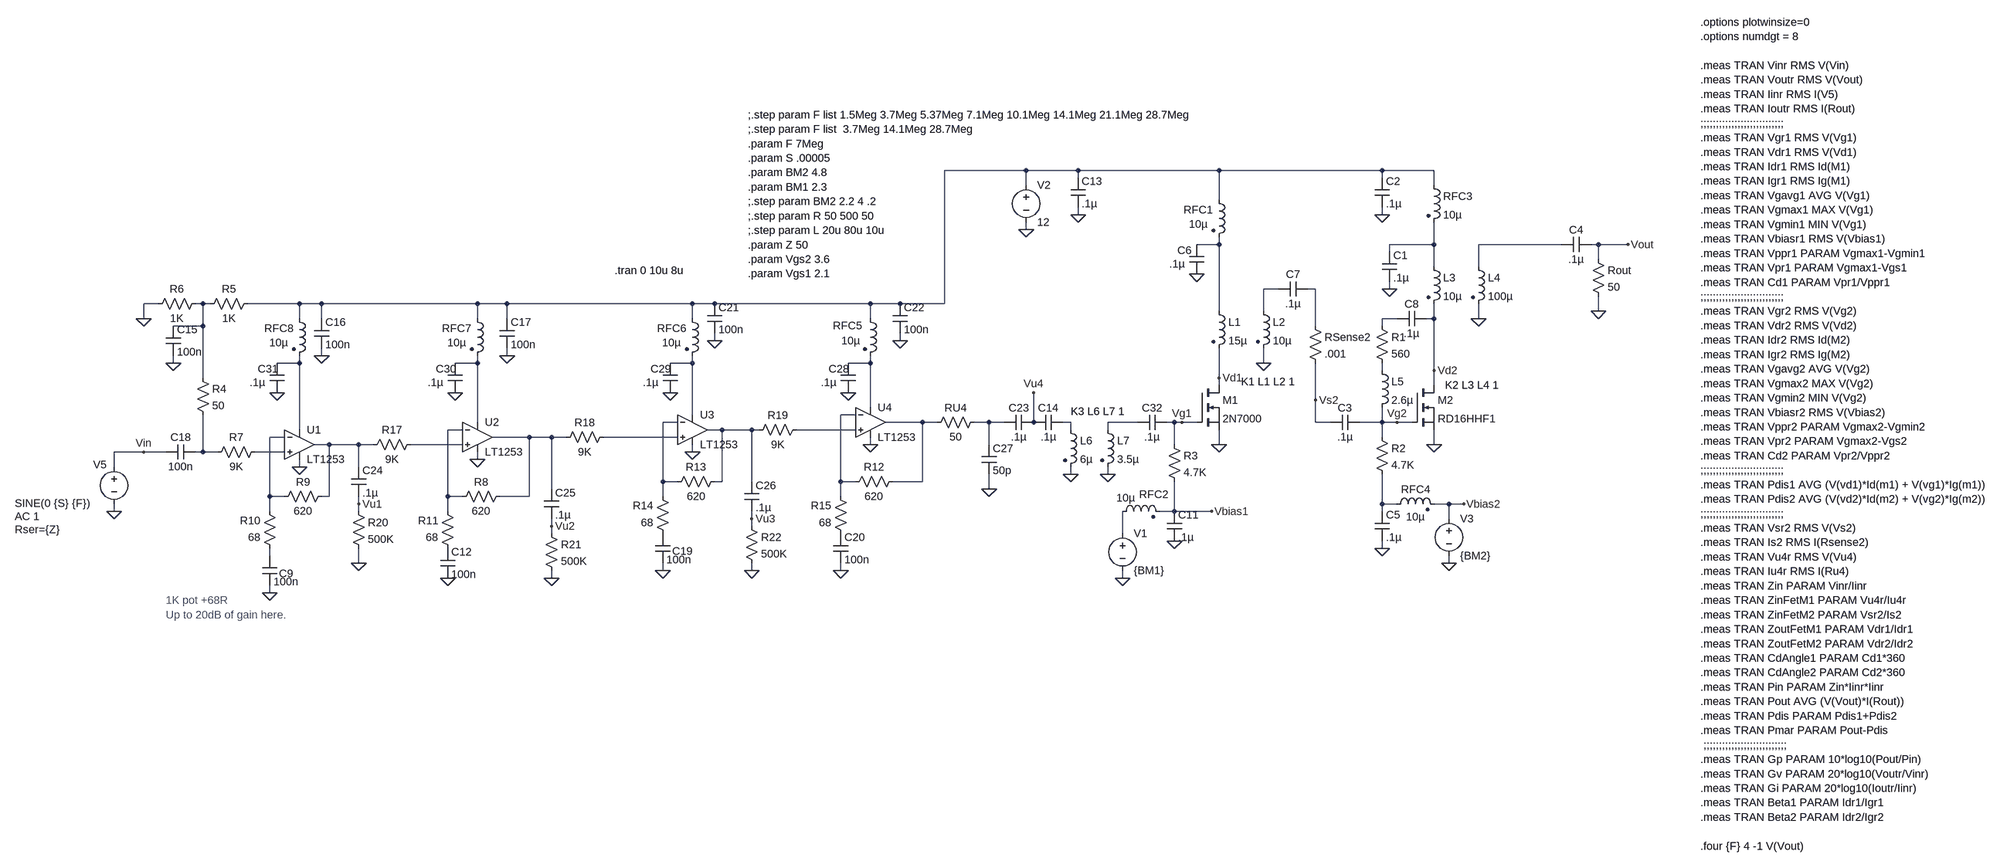
[diagram p0: schematic LT1253 2N7000 RD16HHF Power Amp Testing.asc]
LT1253 2N7000 RD16HHF Power Amp Testing.asc, the LTspice schematic file:
Version 4
SHEET 1 3136 1616
WIRE 256 -176 80 -176
WIRE 368 -176 256 -176
WIRE 672 -176 368 -176
WIRE 1024 -176 672 -176
WIRE 1136 -176 1024 -176
WIRE 368 -160 368 -176
WIRE 1024 -160 1024 -176
WIRE 256 -144 256 -176
WIRE 1136 -144 1136 -176
WIRE 672 -112 672 -176
WIRE 368 -80 368 -96
WIRE 1024 -80 1024 -96
WIRE 256 -48 256 -64
WIRE 672 -16 672 -32
WIRE 672 -16 624 -16
WIRE 1136 -16 1136 -64
WIRE 1136 -16 1040 -16
WIRE 1504 -16 1232 -16
WIRE 1584 -16 1568 -16
WIRE 1648 -16 1584 -16
WIRE 1040 0 1040 -16
WIRE 1584 16 1584 -16
WIRE 1136 32 1136 -16
WIRE 1232 32 1232 -16
WIRE 800 80 768 80
WIRE 880 80 864 80
WIRE 1040 80 1040 64
WIRE -1616 112 -1648 112
WIRE -1520 112 -1536 112
WIRE -1504 112 -1520 112
WIRE -1312 112 -1424 112
WIRE -1264 112 -1312 112
WIRE -928 112 -1264 112
WIRE -864 112 -928 112
WIRE -464 112 -864 112
WIRE -416 112 -464 112
WIRE -80 112 -416 112
WIRE -16 112 -80 112
WIRE 80 112 80 -176
WIRE 80 112 -16 112
WIRE 672 128 672 -16
WIRE 768 128 768 80
WIRE 1584 128 1584 96
WIRE -1648 144 -1648 112
WIRE -1312 144 -1312 112
WIRE -1264 144 -1264 112
WIRE -928 144 -928 112
WIRE -864 144 -864 112
WIRE -464 144 -464 112
WIRE -80 144 -80 112
WIRE 1056 144 1024 144
WIRE 1136 144 1136 112
WIRE 1136 144 1120 144
WIRE 1232 144 1232 112
WIRE -1520 160 -1520 112
WIRE -1520 160 -1584 160
WIRE 880 160 880 80
WIRE 1024 160 1024 144
WIRE -416 192 -416 176
WIRE -16 192 -16 176
WIRE -1264 224 -1264 208
WIRE -864 224 -864 208
WIRE -1584 240 -1584 224
WIRE -1312 240 -1312 224
WIRE -1312 240 -1360 240
WIRE -928 240 -928 224
WIRE -928 240 -976 240
WIRE -464 240 -464 224
WIRE -464 240 -512 240
WIRE -80 240 -80 224
WIRE -80 240 -128 240
WIRE 768 240 768 208
WIRE 1024 256 1024 240
WIRE 1136 256 1136 144
WIRE -1520 272 -1520 160
WIRE 672 272 672 208
WIRE 672 288 672 272
WIRE 1136 288 1136 256
WIRE 880 320 880 240
WIRE -80 336 -80 240
WIRE -464 352 -464 240
WIRE -112 352 -144 352
WIRE -928 368 -928 240
WIRE -496 368 -528 368
WIRE 32 368 -48 368
WIRE 64 368 32 368
WIRE 176 368 144 368
WIRE 208 368 176 368
WIRE 272 368 272 304
WIRE 352 368 336 368
WIRE 496 368 432 368
WIRE 576 368 560 368
WIRE 592 368 576 368
WIRE 624 368 592 368
WIRE 880 368 880 320
WIRE 912 368 880 368
WIRE 1024 368 1024 336
WIRE 1024 368 976 368
WIRE 1056 368 1024 368
WIRE 1088 368 1056 368
WIRE -1312 384 -1312 240
WIRE -960 384 -992 384
WIRE -400 384 -432 384
WIRE -336 384 -400 384
WIRE -320 384 -336 384
WIRE -112 384 -240 384
WIRE 352 384 352 368
WIRE 432 384 432 368
WIRE -1344 400 -1376 400
WIRE -816 400 -896 400
WIRE -768 400 -816 400
WIRE -736 400 -768 400
WIRE -496 400 -656 400
WIRE 1024 400 1024 368
WIRE -1248 416 -1280 416
WIRE -1184 416 -1248 416
WIRE -1152 416 -1184 416
WIRE -960 416 -1072 416
WIRE -80 416 -80 400
WIRE 176 416 176 368
WIRE 576 416 576 368
WIRE 672 416 672 384
WIRE 1136 416 1136 384
WIRE -1648 432 -1712 432
WIRE -1600 432 -1648 432
WIRE -1520 432 -1520 352
WIRE -1520 432 -1536 432
WIRE -1488 432 -1520 432
WIRE -1344 432 -1408 432
WIRE -464 432 -464 416
WIRE -928 448 -928 432
WIRE -1712 464 -1712 432
WIRE -1312 464 -1312 448
WIRE -1184 464 -1184 416
WIRE 352 480 352 464
WIRE 432 480 432 464
WIRE -528 496 -528 368
WIRE -496 496 -528 496
WIRE -400 496 -400 384
WIRE -400 496 -416 496
WIRE -336 496 -336 384
WIRE -144 496 -144 352
WIRE -112 496 -144 496
WIRE 32 496 32 368
WIRE 32 496 -32 496
WIRE -768 512 -768 400
WIRE 176 512 176 480
WIRE -1376 528 -1376 400
WIRE -1344 528 -1376 528
WIRE -1248 528 -1248 416
WIRE -1248 528 -1264 528
WIRE -992 528 -992 384
WIRE -960 528 -992 528
WIRE -816 528 -816 400
WIRE -816 528 -880 528
WIRE -528 528 -528 496
WIRE -144 528 -144 496
WIRE -1184 544 -1184 528
WIRE 1024 544 1024 480
WIRE 1056 544 1024 544
WIRE 1168 544 1136 544
WIRE 1200 544 1168 544
WIRE -1712 560 -1712 544
WIRE -1376 560 -1376 528
WIRE -1184 560 -1184 544
WIRE -992 560 -992 528
WIRE 576 560 576 496
WIRE 576 560 544 560
WIRE 656 560 576 560
WIRE 1024 560 1024 544
WIRE -336 576 -336 560
WIRE 1168 576 1168 544
WIRE -768 592 -768 576
WIRE -336 592 -336 576
WIRE -768 608 -768 592
WIRE 464 608 464 560
WIRE 1024 640 1024 624
WIRE -1376 656 -1376 640
WIRE -1184 672 -1184 640
WIRE 1168 672 1168 656
WIRE -528 688 -528 672
WIRE -336 688 -336 672
WIRE -144 688 -144 672
WIRE -768 704 -768 688
WIRE 464 704 464 688
WIRE -1376 736 -1376 720
FLAG 256 -48 0
FLAG 1584 128 0
FLAG 1648 -16 Vout
FLAG 672 416 0
FLAG 592 368 Vg1
FLAG 672 272 Vd1
FLAG 624 48 0
FLAG 576 624 0
FLAG 464 704 0
FLAG 656 560 Vbias1
FLAG 368 -80 0
FLAG 768 240 0
FLAG 1136 416 0
FLAG 1056 368 Vg2
FLAG 1136 256 Vd2
FLAG 1040 80 0
FLAG 1024 -80 0
FLAG 1232 144 0
FLAG 1024 640 0
FLAG 880 320 Vs2
FLAG 1168 672 0
FLAG 1200 544 Vbias2
FLAG -1712 560 0
FLAG -1648 432 Vin
FLAG -1264 224 0
FLAG -1584 240 0
FLAG -1312 464 0
FLAG -928 448 0
FLAG -992 704 0
FLAG -864 224 0
FLAG -1648 144 0
FLAG -1376 736 0
FLAG -416 192 0
FLAG -464 432 0
FLAG -80 416 0
FLAG -144 688 0
FLAG -16 192 0
FLAG -528 688 0
FLAG -1184 544 Vu1
FLAG -1184 672 0
FLAG -768 592 Vu2
FLAG -768 704 0
FLAG -336 576 Vu3
FLAG -336 688 0
FLAG 176 512 0
FLAG -128 304 0
FLAG -512 304 0
FLAG -976 304 0
FLAG -1360 304 0
FLAG 272 304 Vu4
FLAG 352 480 0
FLAG 432 480 0
SYMBOL voltage 256 -160 R0
WINDOW 123 0 0 Left 2
WINDOW 39 0 0 Left 2
SYMATTR InstName V2
SYMATTR Value 12
SYMBOL res 1568 0 R0
SYMATTR InstName Rout
SYMATTR Value 50
SYMBOL nmos 624 288 R0
SYMATTR InstName M1
SYMATTR Value 2N7000
SYMBOL ind2 656 112 R0
SYMATTR InstName L1
SYMATTR Value 15µ
SYMATTR Type ind
SYMBOL res 560 400 R0
SYMATTR InstName R3
SYMATTR Value 4.7K
SYMBOL ind2 656 -128 R0
WINDOW 0 -60 37 Left 2
WINDOW 3 -49 68 Left 2
SYMATTR InstName RFC1
SYMATTR Value 10µ
SYMATTR Type ind
SYMBOL cap 608 -16 R0
WINDOW 0 -26 13 Left 2
WINDOW 3 -43 42 Left 2
SYMATTR InstName C6
SYMATTR Value .1µ
SYMBOL cap 1504 0 R270
WINDOW 0 32 32 VTop 2
WINDOW 3 0 32 VBottom 2
SYMATTR InstName C4
SYMATTR Value .1µ
SYMBOL ind2 448 576 R270
WINDOW 0 37 83 VTop 2
WINDOW 3 61 23 VBottom 2
SYMATTR InstName RFC2
SYMATTR Value 10µ
SYMATTR Type ind
SYMBOL cap 560 560 R0
SYMATTR InstName C11
SYMATTR Value .1µ
SYMBOL voltage 464 592 R0
WINDOW 123 0 0 Left 2
WINDOW 39 0 0 Left 2
SYMATTR InstName V1
SYMATTR Value {BM1}
SYMBOL ind2 752 112 R0
SYMATTR InstName L2
SYMATTR Value 10µ
SYMATTR Type ind
SYMBOL cap 352 -160 R0
SYMATTR InstName C13
SYMATTR Value .1µ
SYMBOL cap 272 384 R270
WINDOW 0 32 32 VTop 2
WINDOW 3 0 32 VBottom 2
SYMATTR InstName C14
SYMATTR Value .1µ
SYMBOL nmos 1088 288 R0
SYMATTR InstName M2
SYMATTR Value RD16HHF1
SYMBOL ind2 1120 16 R0
SYMATTR InstName L3
SYMATTR Value 10µ
SYMATTR Type ind
SYMBOL ind2 1120 -160 R0
SYMATTR InstName RFC3
SYMATTR Value 10µ
SYMATTR Type ind
SYMBOL cap 1024 0 R0
SYMATTR InstName C1
SYMATTR Value .1µ
SYMBOL ind2 1216 16 R0
SYMATTR InstName L4
SYMATTR Value 100µ
SYMATTR Type ind
SYMBOL cap 1008 -160 R0
SYMATTR InstName C2
SYMATTR Value .1µ
SYMBOL res 864 144 R0
SYMATTR InstName RSense2
SYMATTR Value .001
SYMBOL cap 976 352 R90
WINDOW 0 0 32 VBottom 2
WINDOW 3 32 32 VTop 2
SYMATTR InstName C3
SYMATTR Value .1µ
SYMBOL res 1008 384 R0
SYMATTR InstName R2
SYMATTR Value 4.7K
SYMBOL ind2 1040 560 R270
WINDOW 0 32 56 VTop 2
WINDOW 3 4 56 VBottom 2
SYMATTR InstName RFC4
SYMATTR Value 10µ
SYMATTR Type ind
SYMBOL cap 1008 560 R0
SYMATTR InstName C5
SYMATTR Value .1µ
SYMBOL cap 800 96 R270
WINDOW 0 32 32 VTop 2
WINDOW 3 0 32 VBottom 2
SYMATTR InstName C7
SYMATTR Value .1µ
SYMBOL voltage 1168 560 R0
WINDOW 123 0 0 Left 2
WINDOW 39 0 0 Left 2
SYMATTR InstName V3
SYMATTR Value {BM2}
SYMBOL cap 1120 128 R90
WINDOW 0 0 32 VBottom 2
WINDOW 3 32 32 VTop 2
SYMATTR InstName C8
SYMATTR Value .1µ
SYMBOL res 1008 144 R0
SYMATTR InstName R1
SYMATTR Value 560
SYMBOL ind 1008 240 R0
SYMATTR InstName L5
SYMATTR Value 2.6µ
SYMBOL voltage -1712 448 R0
WINDOW 0 -45 11 Left 2
WINDOW 3 -214 95 Left 2
WINDOW 123 -214 123 Left 2
WINDOW 39 -214 151 Left 2
SYMATTR InstName V5
SYMATTR Value SINE(0 {S} {F})
SYMATTR Value2 AC 1
SYMATTR SpiceLine Rser={Z}
SYMBOL Opamps\\LT1253 -1312 352 R0
SYMATTR InstName U1
SYMBOL Opamps\\LT1253 -928 336 R0
SYMATTR InstName U2
SYMBOL res -1536 256 R0
SYMATTR InstName R4
SYMATTR Value 50
SYMBOL res -1408 96 R90
WINDOW 0 0 56 VBottom 2
WINDOW 3 32 56 VTop 2
SYMATTR InstName R5
SYMATTR Value 1K
SYMBOL res -1520 96 R90
WINDOW 0 0 56 VBottom 2
WINDOW 3 32 56 VTop 2
SYMATTR InstName R6
SYMATTR Value 1K
SYMBOL res -1392 416 R90
WINDOW 0 0 56 VBottom 2
WINDOW 3 32 56 VTop 2
SYMATTR InstName R7
SYMATTR Value 9K
SYMBOL res -864 512 R90
WINDOW 0 0 56 VBottom 2
WINDOW 3 32 56 VTop 2
SYMATTR InstName R8
SYMATTR Value 620
SYMBOL res -1248 512 R90
WINDOW 0 0 56 VBottom 2
WINDOW 3 32 56 VTop 2
SYMATTR InstName R9
SYMATTR Value 620
SYMBOL res -1360 656 R180
WINDOW 0 36 76 Left 2
WINDOW 3 36 40 Left 2
SYMATTR InstName R10
SYMATTR Value 68
SYMBOL res -976 656 R180
WINDOW 0 36 76 Left 2
WINDOW 3 36 40 Left 2
SYMATTR InstName R11
SYMATTR Value 68
SYMBOL cap -1392 656 R0
WINDOW 0 36 38 Left 2
SYMATTR InstName C9
SYMATTR Value 100n
SYMBOL cap -1008 640 R0
SYMATTR InstName C12
SYMATTR Value 100n
SYMBOL cap -1600 160 R0
SYMATTR InstName C15
SYMATTR Value 100n
SYMBOL cap -1280 144 R0
SYMATTR InstName C16
SYMATTR Value 100n
SYMBOL cap -880 144 R0
SYMATTR InstName C17
SYMATTR Value 100n
SYMBOL cap -1536 416 R90
WINDOW 0 0 32 VBottom 2
WINDOW 3 32 32 VTop 2
SYMATTR InstName C18
SYMATTR Value 100n
SYMBOL Opamps\\LT1253 -464 320 R0
SYMATTR InstName U3
SYMBOL Opamps\\LT1253 -80 304 R0
SYMATTR InstName U4
SYMBOL res -16 480 R90
WINDOW 0 0 56 VBottom 2
WINDOW 3 32 56 VTop 2
SYMATTR InstName R12
SYMATTR Value 620
SYMBOL res -400 480 R90
WINDOW 0 0 56 VBottom 2
WINDOW 3 32 56 VTop 2
SYMATTR InstName R13
SYMATTR Value 620
SYMBOL res -512 624 R180
WINDOW 0 36 76 Left 2
WINDOW 3 36 40 Left 2
SYMATTR InstName R14
SYMATTR Value 68
SYMBOL res -128 624 R180
WINDOW 0 36 76 Left 2
WINDOW 3 36 40 Left 2
SYMATTR InstName R15
SYMATTR Value 68
SYMBOL cap -544 608 R0
WINDOW 0 36 38 Left 2
SYMATTR InstName C19
SYMATTR Value 100n
SYMBOL cap -160 608 R0
SYMATTR InstName C20
SYMATTR Value 100n
SYMBOL cap -432 112 R0
SYMATTR InstName C21
SYMATTR Value 100n
SYMBOL cap -32 112 R0
SYMATTR InstName C22
SYMATTR Value 100n
SYMBOL res 160 352 R90
WINDOW 0 0 56 VBottom 2
WINDOW 3 32 56 VTop 2
SYMATTR InstName RU4
SYMATTR Value 50
SYMBOL res -1056 400 R90
WINDOW 0 0 56 VBottom 2
WINDOW 3 32 56 VTop 2
SYMATTR InstName R17
SYMATTR Value 9K
SYMBOL res -640 384 R90
WINDOW 0 0 56 VBottom 2
WINDOW 3 32 56 VTop 2
SYMATTR InstName R18
SYMATTR Value 9K
SYMBOL res -224 368 R90
WINDOW 0 0 56 VBottom 2
WINDOW 3 32 56 VTop 2
SYMATTR InstName R19
SYMATTR Value 9K
SYMBOL cap -1200 464 R0
SYMATTR InstName C24
SYMATTR Value .1µ
SYMBOL res -1200 544 R0
SYMATTR InstName R20
SYMATTR Value 500K
SYMBOL cap -784 512 R0
SYMATTR InstName C25
SYMATTR Value .1µ
SYMBOL res -784 592 R0
SYMATTR InstName R21
SYMATTR Value 500K
SYMBOL cap -352 496 R0
SYMATTR InstName C26
SYMATTR Value .1µ
SYMBOL res -352 576 R0
SYMATTR InstName R22
SYMATTR Value 500K
SYMBOL cap 160 416 R0
SYMATTR InstName C27
SYMATTR Value 50p
SYMBOL ind2 -96 128 R0
WINDOW 0 -65 31 Left 2
WINDOW 3 -47 64 Left 2
SYMATTR InstName RFC5
SYMATTR Value 10µ
SYMATTR Type ind
SYMBOL cap -144 240 R0
WINDOW 0 -26 13 Left 2
WINDOW 3 -43 42 Left 2
SYMATTR InstName C28
SYMATTR Value .1µ
SYMBOL ind2 -480 128 R0
WINDOW 0 -60 37 Left 2
WINDOW 3 -49 68 Left 2
SYMATTR InstName RFC6
SYMATTR Value 10µ
SYMATTR Type ind
SYMBOL cap -528 240 R0
WINDOW 0 -26 13 Left 2
WINDOW 3 -43 42 Left 2
SYMATTR InstName C29
SYMATTR Value .1µ
SYMBOL ind2 -944 128 R0
WINDOW 0 -60 37 Left 2
WINDOW 3 -49 68 Left 2
SYMATTR InstName RFC7
SYMATTR Value 10µ
SYMATTR Type ind
SYMBOL cap -992 240 R0
WINDOW 0 -26 13 Left 2
WINDOW 3 -43 42 Left 2
SYMATTR InstName C30
SYMATTR Value .1µ
SYMBOL ind2 -1328 128 R0
WINDOW 0 -60 37 Left 2
WINDOW 3 -49 68 Left 2
SYMATTR InstName RFC8
SYMATTR Value 10µ
SYMATTR Type ind
SYMBOL cap -1376 240 R0
WINDOW 0 -26 13 Left 2
WINDOW 3 -43 42 Left 2
SYMATTR InstName C31
SYMATTR Value .1µ
SYMBOL cap 208 384 R270
WINDOW 0 32 32 VTop 2
WINDOW 3 0 32 VBottom 2
SYMATTR InstName C23
SYMATTR Value .1µ
SYMBOL ind2 336 368 R0
SYMATTR InstName L6
SYMATTR Value 6µ
SYMATTR Type ind
SYMBOL ind2 416 368 R0
SYMATTR InstName L7
SYMATTR Value 3.5µ
SYMATTR Type ind
SYMBOL cap 496 384 R270
WINDOW 0 32 32 VTop 2
WINDOW 3 0 32 VBottom 2
SYMATTR InstName C32
SYMATTR Value .1µ
TEXT 1896 -496 Left 2 !.options plotwinsize=0\n.options numdgt = 8\n \n.meas TRAN Vinr RMS V(Vin)\n.meas TRAN Voutr RMS V(Vout)\n.meas TRAN Iinr RMS I(V5)\n.meas TRAN Ioutr RMS I(Rout)\n;;;;;;;;;;;;;;;;;;;;;;;;;;;\n.meas TRAN Vgr1 RMS V(Vg1)\n.meas TRAN Vdr1 RMS V(Vd1)\n.meas TRAN Idr1 RMS Id(M1)\n.meas TRAN Igr1 RMS Ig(M1)\n.meas TRAN Vgavg1 AVG V(Vg1)\n.meas TRAN Vgmax1 MAX V(Vg1)\n.meas TRAN Vgmin1 MIN V(Vg1)\n.meas TRAN Vbiasr1 RMS V(Vbias1)\n.meas TRAN Vppr1 PARAM Vgmax1-Vgmin1\n.meas TRAN Vpr1 PARAM Vgmax1-Vgs1\n.meas TRAN Cd1 PARAM Vpr1/Vppr1\n;;;;;;;;;;;;;;;;;;;;;;;;;;;\n.meas TRAN Vgr2 RMS V(Vg2)\n.meas TRAN Vdr2 RMS V(Vd2)\n.meas TRAN Idr2 RMS Id(M2)\n.meas TRAN Igr2 RMS Ig(M2)\n.meas TRAN Vgavg2 AVG V(Vg2)\n.meas TRAN Vgmax2 MAX V(Vg2)\n.meas TRAN Vgmin2 MIN V(Vg2)\n.meas TRAN Vbiasr2 RMS V(Vbias2)\n.meas TRAN Vppr2 PARAM Vgmax2-Vgmin2\n.meas TRAN Vpr2 PARAM Vgmax2-Vgs2\n.meas TRAN Cd2 PARAM Vpr2/Vppr2\n;;;;;;;;;;;;;;;;;;;;;;;;;;;\n.meas TRAN Pdis1 AVG (V(vd1)*Id(m1) + V(vg1)*Ig(m1))\n.meas TRAN Pdis2 AVG (V(vd2)*Id(m2) + V(vg2)*Ig(m2))\n;;;;;;;;;;;;;;;;;;;;;;;;;;;\n.meas TRAN Vsr2 RMS V(Vs2)\n.meas TRAN Is2 RMS I(Rsense2)\n.meas TRAN Vu4r RMS V(Vu4)\n.meas TRAN Iu4r RMS I(Ru4)\n.meas TRAN Zin PARAM Vinr/Iinr\n.meas TRAN ZinFetM1 PARAM Vu4r/Iu4r\n.meas TRAN ZinFetM2 PARAM Vsr2/Is2\n.meas TRAN ZoutFetM1 PARAM Vdr1/Idr1\n.meas TRAN ZoutFetM2 PARAM Vdr2/Idr2\n.meas TRAN CdAngle1 PARAM Cd1*360\n.meas TRAN CdAngle2 PARAM Cd2*360\n.meas TRAN Pin PARAM Zin*Iinr*Iinr\n.meas TRAN Pout AVG (V(Vout)*I(Rout))\n.meas TRAN Pdis PARAM Pdis1+Pdis2\n.meas TRAN Pmar PARAM Pout-Pdis\n ;;;;;;;;;;;;;;;;;;;;;;;;;;;\n.meas TRAN Gp PARAM 10*log10(Pout/Pin)\n.meas TRAN Gv PARAM 20*log10(Voutr/Vinr)\n.meas TRAN Gi PARAM 20*log10(Ioutr/Iinr)\n.meas TRAN Beta1 PARAM Idr1/Igr1\n.meas TRAN Beta2 PARAM Idr2/Igr2\n \n.four {F} 4 -1 V(Vout)
TEXT -344 -296 Left 2 !;.step param F list 1.5Meg 3.7Meg 5.37Meg 7.1Meg 10.1Meg 14.1Meg 21.1Meg 28.7Meg\n;.step param F list  3.7Meg 14.1Meg 28.7Meg\n.param F 7Meg\n.param S .00005\n.param BM2 4.8\n.param BM1 2.3\n;.step param BM2 2.2 4 .2\n;.step param R 50 500 50\n;.step param L 20u 80u 10u\n.param Z 50\n.param Vgs2 3.6\n.param Vgs1 2.1
TEXT 720 280 Left 2 !K1 L1 L2 1
TEXT 1160 288 Left 2 !K2 L3 L4 1
TEXT -1600 752 Left 2 ;1K pot +68R  \nUp to 20dB of gain here.
TEXT -632 40 Left 2 !.tran 0 10u 8u
TEXT 352 344 Left 2 !K3 L6 L7 1

The netlist it stands for:
* LT1253 2N7000 RD16HHF Power Amp Testing.asc
V2 N001 0 12
Rout Vout 0 50
M1 Vd1 Vg1 0 0 2N7000
L1 N002 Vd1 15µ
R3 Vg1 Vbias1 4.7K
L§RFC1 N001 N002 10µ
C6 N002 0 .1µ
C4 N004 Vout .1µ
L§RFC2 N031 Vbias1 10µ
C11 Vbias1 0 .1µ
V1 N031 0 {BM1}
L2 N005 0 10µ
C13 N001 0 .1µ
C14 Vu4 N018 .1µ
M2 Vd2 Vg2 0 0 RD16HHF1
L3 N003 Vd2 10µ
L§RFC3 N001 N003 10µ
C1 N003 0 .1µ
L4 N004 0 100µ
C2 N001 0 .1µ
RSense2 N006 Vs2 .001
C3 Vg2 Vs2 .1µ
R2 Vg2 N030 4.7K
L§RFC4 N030 Vbias2 10µ
C5 N030 0 .1µ
C7 N005 N006 .1µ
V3 Vbias2 0 {BM2}
C8 Vd2 N008 .1µ
R1 N008 N013 560
L5 N013 Vg2 2.6µ
V5 Vin 0 SINE(0 {S} {F}) AC 1 Rser={Z}
XU1 N029 N023 N009 0 N026 LT1253  ; pins In+ In- V+ V- OUT
XU2 N027 N020 N010 0 N024 LT1253  ; pins In+ In- V+ V- OUT
R4 N007 N028 50
R5 N001 N007 1K
R6 N007 0 1K
R7 N029 N028 9K
R8 N024 N020 620
R9 N026 N023 620
R10 N032 N023 68
R11 P001 N020 68
C9 N032 0 100n
C12 P001 0 100n
C15 N007 0 100n
C16 N001 0 100n
C17 N001 0 100n
C18 N028 Vin 100n
XU3 N025 N015 N011 0 N021 LT1253  ; pins In+ In- V+ V- OUT
XU4 N022 N014 N012 0 N016 LT1253  ; pins In+ In- V+ V- OUT
R12 N016 N014 620
R13 N021 N015 620
R14 P002 N015 68
R15 P003 N014 68
C19 P002 0 100n
C20 P003 0 100n
C21 N001 0 100n
C22 N001 0 100n
RU4 N017 N016 50
R17 N027 N026 9K
R18 N025 N024 9K
R19 N022 N021 9K
C24 N026 Vu1 .1µ
R20 Vu1 0 500K
C25 N024 Vu2 .1µ
R21 Vu2 0 500K
C26 N021 Vu3 .1µ
R22 Vu3 0 500K
C27 N017 0 50p
L§RFC5 N001 N012 10µ
C28 N012 0 .1µ
L§RFC6 N001 N011 10µ
C29 N011 0 .1µ
L§RFC7 N001 N010 10µ
C30 N010 0 .1µ
L§RFC8 N001 N009 10µ
C31 N009 0 .1µ
C23 N017 Vu4 .1µ
L6 N018 0 6µ
L7 N019 0 3.5µ
C32 N019 Vg1 .1µ
.model NMOS NMOS
.model PMOS PMOS
.lib standard.mos
.options plotwinsize=0
.options numdgt = 8
.meas TRAN Vinr RMS V(Vin)
.meas TRAN Voutr RMS V(Vout)
.meas TRAN Iinr RMS I(V5)
.meas TRAN Ioutr RMS I(Rout)
;;;;;;;;;;;;;;;;;;;;;;;;;;;
.meas TRAN Vgr1 RMS V(Vg1)
.meas TRAN Vdr1 RMS V(Vd1)
.meas TRAN Idr1 RMS Id(M1)
.meas TRAN Igr1 RMS Ig(M1)
.meas TRAN Vgavg1 AVG V(Vg1)
.meas TRAN Vgmax1 MAX V(Vg1)
.meas TRAN Vgmin1 MIN V(Vg1)
.meas TRAN Vbiasr1 RMS V(Vbias1)
.meas TRAN Vppr1 PARAM Vgmax1-Vgmin1
.meas TRAN Vpr1 PARAM Vgmax1-Vgs1
.meas TRAN Cd1 PARAM Vpr1/Vppr1
;;;;;;;;;;;;;;;;;;;;;;;;;;;
.meas TRAN Vgr2 RMS V(Vg2)
.meas TRAN Vdr2 RMS V(Vd2)
.meas TRAN Idr2 RMS Id(M2)
.meas TRAN Igr2 RMS Ig(M2)
.meas TRAN Vgavg2 AVG V(Vg2)
.meas TRAN Vgmax2 MAX V(Vg2)
.meas TRAN Vgmin2 MIN V(Vg2)
.meas TRAN Vbiasr2 RMS V(Vbias2)
.meas TRAN Vppr2 PARAM Vgmax2-Vgmin2
.meas TRAN Vpr2 PARAM Vgmax2-Vgs2
.meas TRAN Cd2 PARAM Vpr2/Vppr2
;;;;;;;;;;;;;;;;;;;;;;;;;;;
.meas TRAN Pdis1 AVG (V(vd1)*Id(m1) + V(vg1)*Ig(m1))
.meas TRAN Pdis2 AVG (V(vd2)*Id(m2) + V(vg2)*Ig(m2))
;;;;;;;;;;;;;;;;;;;;;;;;;;;
.meas TRAN Vsr2 RMS V(Vs2)
.meas TRAN Is2 RMS I(Rsense2)
.meas TRAN Vu4r RMS V(Vu4)
.meas TRAN Iu4r RMS I(Ru4)
.meas TRAN Zin PARAM Vinr/Iinr
.meas TRAN ZinFetM1 PARAM Vu4r/Iu4r
.meas TRAN ZinFetM2 PARAM Vsr2/Is2
.meas TRAN ZoutFetM1 PARAM Vdr1/Idr1
.meas TRAN ZoutFetM2 PARAM Vdr2/Idr2
.meas TRAN CdAngle1 PARAM Cd1*360
.meas TRAN CdAngle2 PARAM Cd2*360
.meas TRAN Pin PARAM Zin*Iinr*Iinr
.meas TRAN Pout AVG (V(Vout)*I(Rout))
.meas TRAN Pdis PARAM Pdis1+Pdis2
.meas TRAN Pmar PARAM Pout-Pdis
 ;;;;;;;;;;;;;;;;;;;;;;;;;;;
.meas TRAN Gp PARAM 10*log10(Pout/Pin)
.meas TRAN Gv PARAM 20*log10(Voutr/Vinr)
.meas TRAN Gi PARAM 20*log10(Ioutr/Iinr)
.meas TRAN Beta1 PARAM Idr1/Igr1
.meas TRAN Beta2 PARAM Idr2/Igr2
.four {F} 4 -1 V(Vout)
;.step param F list 1.5Meg 3.7Meg 5.37Meg 7.1Meg 10.1Meg 14.1Meg 21.1Meg 28.7Meg
;.step param F list  3.7Meg 14.1Meg 28.7Meg
.param F 7Meg
.param S .00005
.param BM2 4.8
.param BM1 2.3
;.step param BM2 2.2 4 .2
;.step param R 50 500 50
;.step param L 20u 80u 10u
.param Z 50
.param Vgs2 3.6
.param Vgs1 2.1
K1 L1 L2 1
K2 L3 L4 1
* 1K pot +68R
* Up to 20dB of gain here.
.tran 0 10u 8u
K3 L6 L7 1
.backanno
.end